# EAGLE design RoboClawAddOn (EAGLE 5.11)
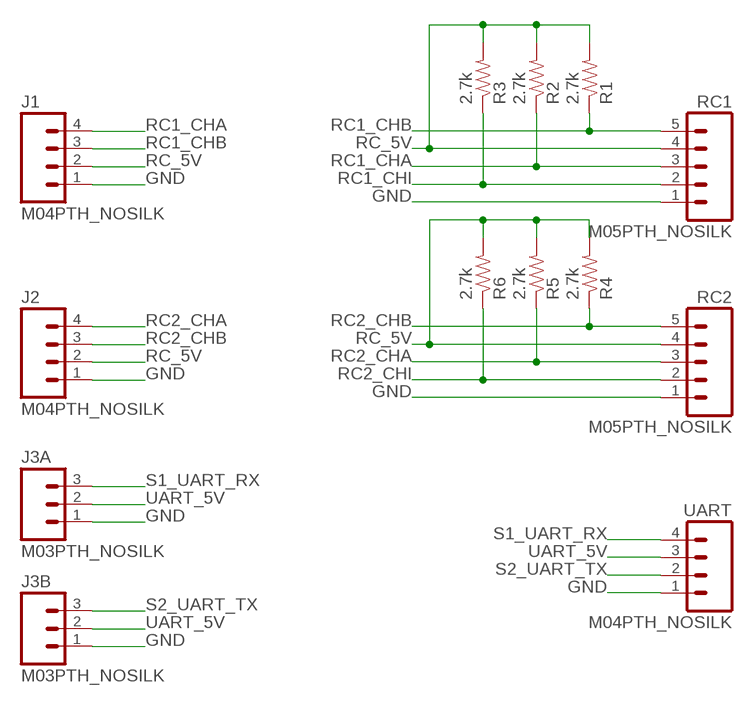
[diagram p0: schematic, sheet 1]

## Parts
J1  M04PTH_NOSILK  [1X04/NOSILK]
J2  M04PTH_NOSILK  [1X04/NOSILK]
J3A  M03PTH_NOSILK  [1X03/NOSILK]
J3B  M03PTH_NOSILK  [1X03/NOSILK]
R1  2.7k  RESISTOR0805  [0805]
R2  2.7k  RESISTOR0805  [0805]
R3  2.7k  RESISTOR0805  [0805]
R4  2.7k  RESISTOR0805  [0805]
R5  2.7k  RESISTOR0805  [0805]
R6  2.7k  RESISTOR0805  [0805]
RC1  M05PTH_NOSILK  [1X05/90/NOSILK]
RC2  M05PTH_NOSILK  [1X05/90/NOSILK]
UART  M04PTH_NOSILK  [1X04/NOSILK]

## Nets
GND: J1.1 J2.1 J3A.1 J3B.1 RC1.1 RC2.1 UART.1
RC1_CHA: J1.4 R2.1 RC1.3
RC1_CHB: J1.3 R1.1 RC1.5
RC1_CHI: R3.1 RC1.2
RC2_CHA: J2.4 R5.1 RC2.3
RC2_CHB: J2.3 R4.1 RC2.5
RC2_CHI: R6.1 RC2.2
RC_5V: J1.2 J2.2 R1.2 R2.2 R3.2 R4.2 R5.2 R6.2 RC1.4 RC2.4
S1_UART_RX: J3A.3 UART.4
S2_UART_TX: J3B.3 UART.2
UART_5V: J3A.2 J3B.2 UART.3

## Library data of the parts
J1 J2 UART = Robot:M04: 4-PIN HEADER Standard 4-pin 0.1" header.
J3A J3B = Robot:M03: 3-PIN HEADER Standard 3-pin 0.1" header.
R1-R6 = Robot:RESISTOR: RESISTOR
RC1 RC2 = Robot:M05: 5-PIN HEADER Standard 5-pin 0.1" header.

## Board
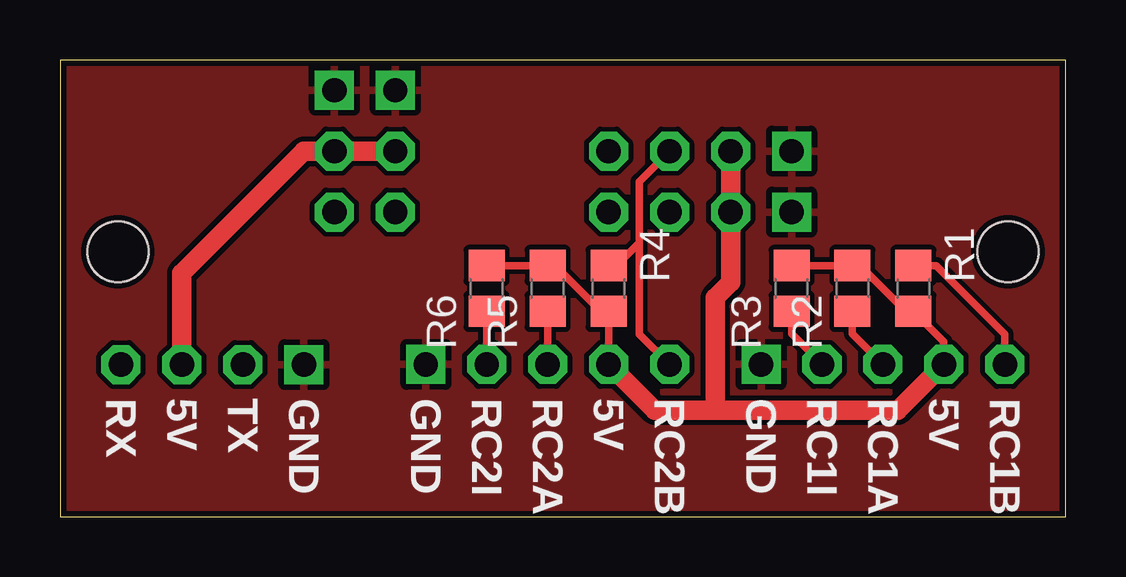
[diagram p1: board, top side]
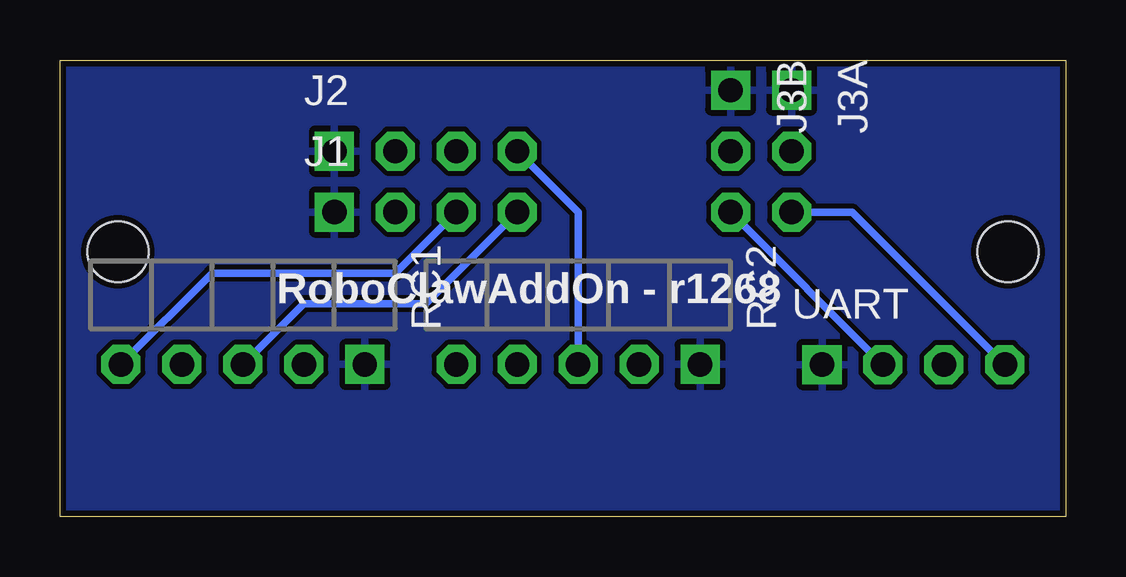
[diagram p2: board, bottom side, seen from below]

Size 41.91 x 19.04 mm. Coordinates in mm from the lower left corner, seen from the top.
Outline: 0,0 41.91,0 41.91,19.04 0,19.04 0,0
Copper layers (1*16): Top 0.035mm / dielectric 1.5mm / Bottom 0.035mm
Design rules "SparkFun": minimum track width 8mil, minimum drill 20mil, track to track 8mil, track to pad 8mil, pad to pad 8mil, via to via 8mil, smd to smd 8mil, copper to edge 10mil, drill to drill 8mil, minimum pad ring 12mil, minimum via ring 10mil, stop-mask expansion 4mil, vias tented up to drill 25mil, thermal gap 10mil
Holes 2.54 mm at 2.41,11.05 39.5,11.05

### Footprints (pad centres in the part's own frame; a part is rotated, then mirrored left to right if it is on the bottom)
1X04/NOSILK = drill 1.016 square: 1 -3.81,0 | drill 1.016 octagon: 2 -1.27,0; 3 1.27,0; 4 3.81,0
1X03/NOSILK = drill 1.016 square: 1 -2.54,0 | drill 1.016 octagon: 2 0,0; 3 2.54,0
0805 = smd 1.3 x 1.5: 1 -0.95,0; 2 0.95,0
1X05/90/NOSILK = drill 1.016 square: 1 0,-0.01 | drill 1.016 octagon: 2 2.54,-0.01; 3 5.08,-0.01; 4 7.62,-0.01; 5 10.16,-0.01

### Placement (x,y rotation side)
J1  26.67,12.7 0 bottom
J2  26.67,15.24 0 bottom
J3A  11.43,15.24 270 bottom
J3B  13.97,15.24 270 bottom
R1  35.56,9.53 270 top
R2  33.02,9.53 90 top
R3  30.48,9.53 90 top
R4  22.86,9.53 270 top
R5  20.32,9.53 90 top
R6  17.78,9.53 90 top
RC1  29.21,6.35 180 bottom
RC2  15.24,6.35 180 bottom
UART  6.35,6.35 0 bottom

### Tracks (layer width: path | path; a pad name or v marks a point on that pad's centre or on a via)
GND
  pour Bottom: 0,0 0,19.05 41.91,19.05 41.91,0
  pour Top: 0,0 0,19.05 41.91,19.05 41.91,0
RC1_CHA
  Top 0.305: R2.1 33.02,7.63 RC1.3
  Bottom 0.305: RC1.3 31.75,8.89 26.67,8.89 J1.4
RC1_CHB
  Top 0.305: R1.1 36.52,10.47 39.37,7.62 RC1.5
  Bottom 0.305: J1.3 27.94,10.16 35.57,10.16 RC1.5
RC1_CHI
  Top 0.305: R3.1 30.48,7.63 RC1.2
RC2_CHA
  Top 0.305: RC2.3 R5.1
  Bottom 0.305: J2.4 20.32,12.7 RC2.3
RC2_CHB
  Top 0.305: 23.18,10.47 R4.1 23.18,10.47 24.13,11.43 | J2.3 24.13,13.97 24.13,11.43 | RC2.5 24.13,7.62 24.13,11.43
RC2_CHI
  Top 0.305: RC2.2 R6.1
RC_5V
  Top 0.305: R6.2 R5.2 20.64,10.47 22.23,8.89 22.55,8.89 R4.2 RC2.4 | RC1.4 36.83,7.3 R1.2 35.24,8.57 33.66,10.16 33.34,10.16 R2.2 R3.2
  Top 0.813: 27.3,4.45 27.3,9.14 27.94,9.78 J1.2 J2.2 | 27.3,4.45 24.77,4.45 RC2.4 | 27.3,4.45 34.91,4.45 RC1.4
S1_UART_RX
  Bottom 0.305: UART.4 8.9,12.7 J3A.3
S2_UART_TX
  Bottom 0.305: UART.2 J3B.3
UART_5V
  Top 0.813: UART.3 5.08,10.16 10.16,15.24 J3A.2 J3B.2

### Text on the board
tPlace: RX | 5V | TX | GND | GND | RC2I | RC2A | 5V | RC2B | GND | RC1I | RC1A | 5V | RC1B
bPlace: RoboClawAddOn - r1268